# Altium schematic sheet 4_LEDS_SEGMENT.SchDoc
size A; SheetNumber: 2; SheetTotal: 9
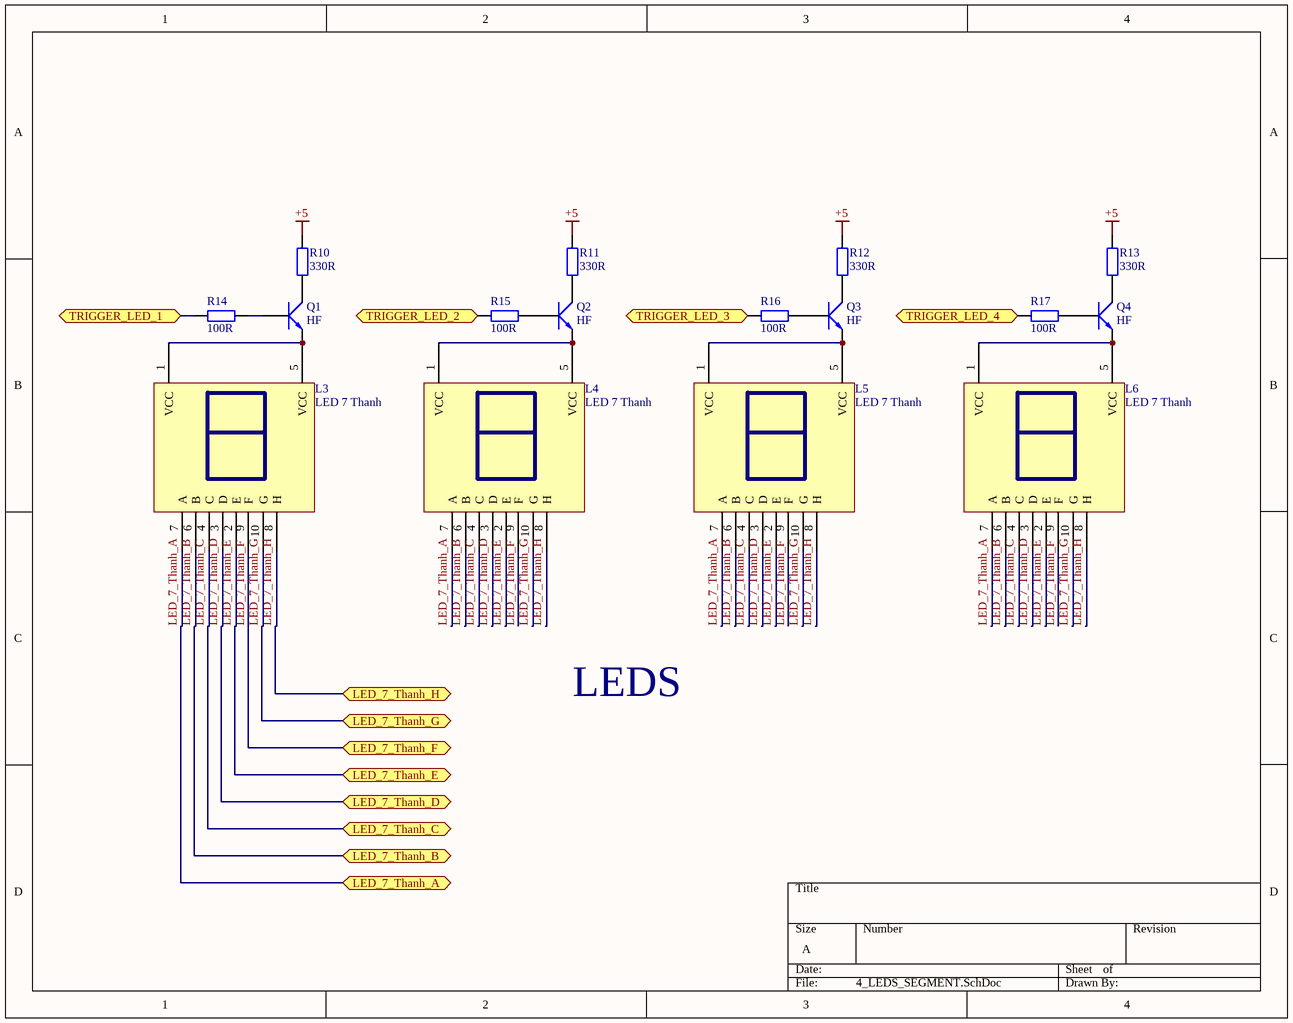
[diagram p0: 4_LEDS_SEGMENT.SchDoc]

## Parts
L3  LED 7 Thanh  [LED7SEG_2.3inch]
L4  LED 7 Thanh  [LED7SEG_2.3inch]
L5  LED 7 Thanh  [LED7SEG_2.3inch]
L6  LED 7 Thanh  [LED7SEG_2.3inch]
Q1  HF  [SOT23]
Q2  HF  [SOT23]
Q3  HF  [SOT23]
Q4  HF  [SOT23]
R10  330R  [tro smd 0603]
R11  330R  [tro smd 0603]
R12  330R  [tro smd 0603]
R13  330R  [tro smd 0603]
R14  100R  [tro smd 0603]
R15  100R  [tro smd 0603]
R16  100R  [tro smd 0603]
R17  100R  [tro smd 0603]

## Ports
LED_7_Thanh_A (bidir), LED_7_Thanh_B (bidir), LED_7_Thanh_C (bidir), LED_7_Thanh_D (bidir), LED_7_Thanh_E (bidir), LED_7_Thanh_F (bidir), LED_7_Thanh_G (bidir), LED_7_Thanh_H (bidir), TRIGGER_LED_1 (bidir), TRIGGER_LED_2 (bidir), TRIGGER_LED_3 (bidir), TRIGGER_LED_4 (bidir)

## Nets
+5: R10.2 R11.2 R12.2 R13.2
LED_7_Thanh_A: L3.7(A) L4.7(A) L5.7(A) L6.7(A) ; port LED_7_Thanh_A
LED_7_Thanh_B: L3.6(B) L4.6(B) L5.6(B) L6.6(B) ; port LED_7_Thanh_B
LED_7_Thanh_C: L3.4(C) L4.4(C) L5.4(C) L6.4(C) ; port LED_7_Thanh_C
LED_7_Thanh_D: L3.3(D) L4.3(D) L5.3(D) L6.3(D) ; port LED_7_Thanh_D
LED_7_Thanh_E: L3.2(E) L4.2(E) L5.2(E) L6.2(E) ; port LED_7_Thanh_E
LED_7_Thanh_F: L3.9(F) L4.9(F) L5.9(F) L6.9(F) ; port LED_7_Thanh_F
LED_7_Thanh_G: L3.10(G) L4.10(G) L5.10(G) L6.10(G) ; port LED_7_Thanh_G
LED_7_Thanh_H: L3.8(H) L4.8(H) L5.8(H) L6.8(H) ; port LED_7_Thanh_H
TRIGGER_LED_1: R14.1 ; port TRIGGER_LED_1
TRIGGER_LED_2: R15.1 ; port TRIGGER_LED_2
TRIGGER_LED_3: R16.1 ; port TRIGGER_LED_3
TRIGGER_LED_4: R17.1 ; port TRIGGER_LED_4
NetL3_1: L3.1(VCC) L3.5(VCC) Q1.2(E)
NetL4_1: L4.1(VCC) L4.5(VCC) Q2.2(E)
NetL5_1: L5.1(VCC) L5.5(VCC) Q3.2(E)
NetL6_1: L6.1(VCC) L6.5(VCC) Q4.2(E)
NetQ1_1: Q1.1(B) R14.2
NetQ1_3: Q1.3(C) R10.1
NetQ2_1: Q2.1(B) R15.2
NetQ2_3: Q2.3(C) R11.1
NetQ3_1: Q3.1(B) R16.2
NetQ3_3: Q3.3(C) R12.1
NetQ4_1: Q4.1(B) R17.2
NetQ4_3: Q4.3(C) R13.1

## Notes on the sheet
- LEDS

## Library data of the parts
L3-L6 = LED 7x1 2.3inch Anot: Dán; Don_Vi: Con; Ma_Hang: MH000901; Ten_Linh_Kien: Led 7 2.3 1 Số Anot (Sáng Đỏ); Ghi_Chu: *; Kieu_Chan: *; Chung_Loai: Dán
Q1-Q4 = C1815 HF SMD: NPN transistor; Value: C9014
R10-R13 = Tro 0603 5% 330R: Dán; Don_Vi: Con; Ma_Hang: MH006910; So_Chan: 2; Ten_Linh_Kien: Trở 0603 5% 330R; Chung_Loai: Dán; Kieu_Chan: *
R14-R17 = Tro 0603 5% 100R: Dán; Don_Vi: Con; So_Chan: 2; Ten_Linh_Kien: Trở 0603 5% 100R; Ma_Hang: MH006315; Chung_Loai: Dán; Kieu_Chan: *